# Altium schematic sheet SC945D_Alimentations.SchDoc: Alimentations
size 393 x 270 mm; CompanyName: Seccom; Address1: 521, rue du capt. François Garbit; Address2: 69440 Mornant; Address3: seccom@seccom.fr; Address4: www.seccom.fr; DocumentNumber: 3; SheetNumber: 3; SheetTotal: 9; PageSetup: Record=PageOptions|CenterHorizontal=True|CenterVertical=True|PrintScale=0.74|XCorrection=1.00|YCorrection=1.00|PrintKind=0|BorderSize=5000000|LeftOffset=0|BottomOffset=0|Orientation=2|PaperLength=1000|PaperWidth=1000|Scale=100|PaperSource=7|PrintQuality=-4|MediaType=1|DitherType=10|PaperKind=A4|PrintScaleMode=1
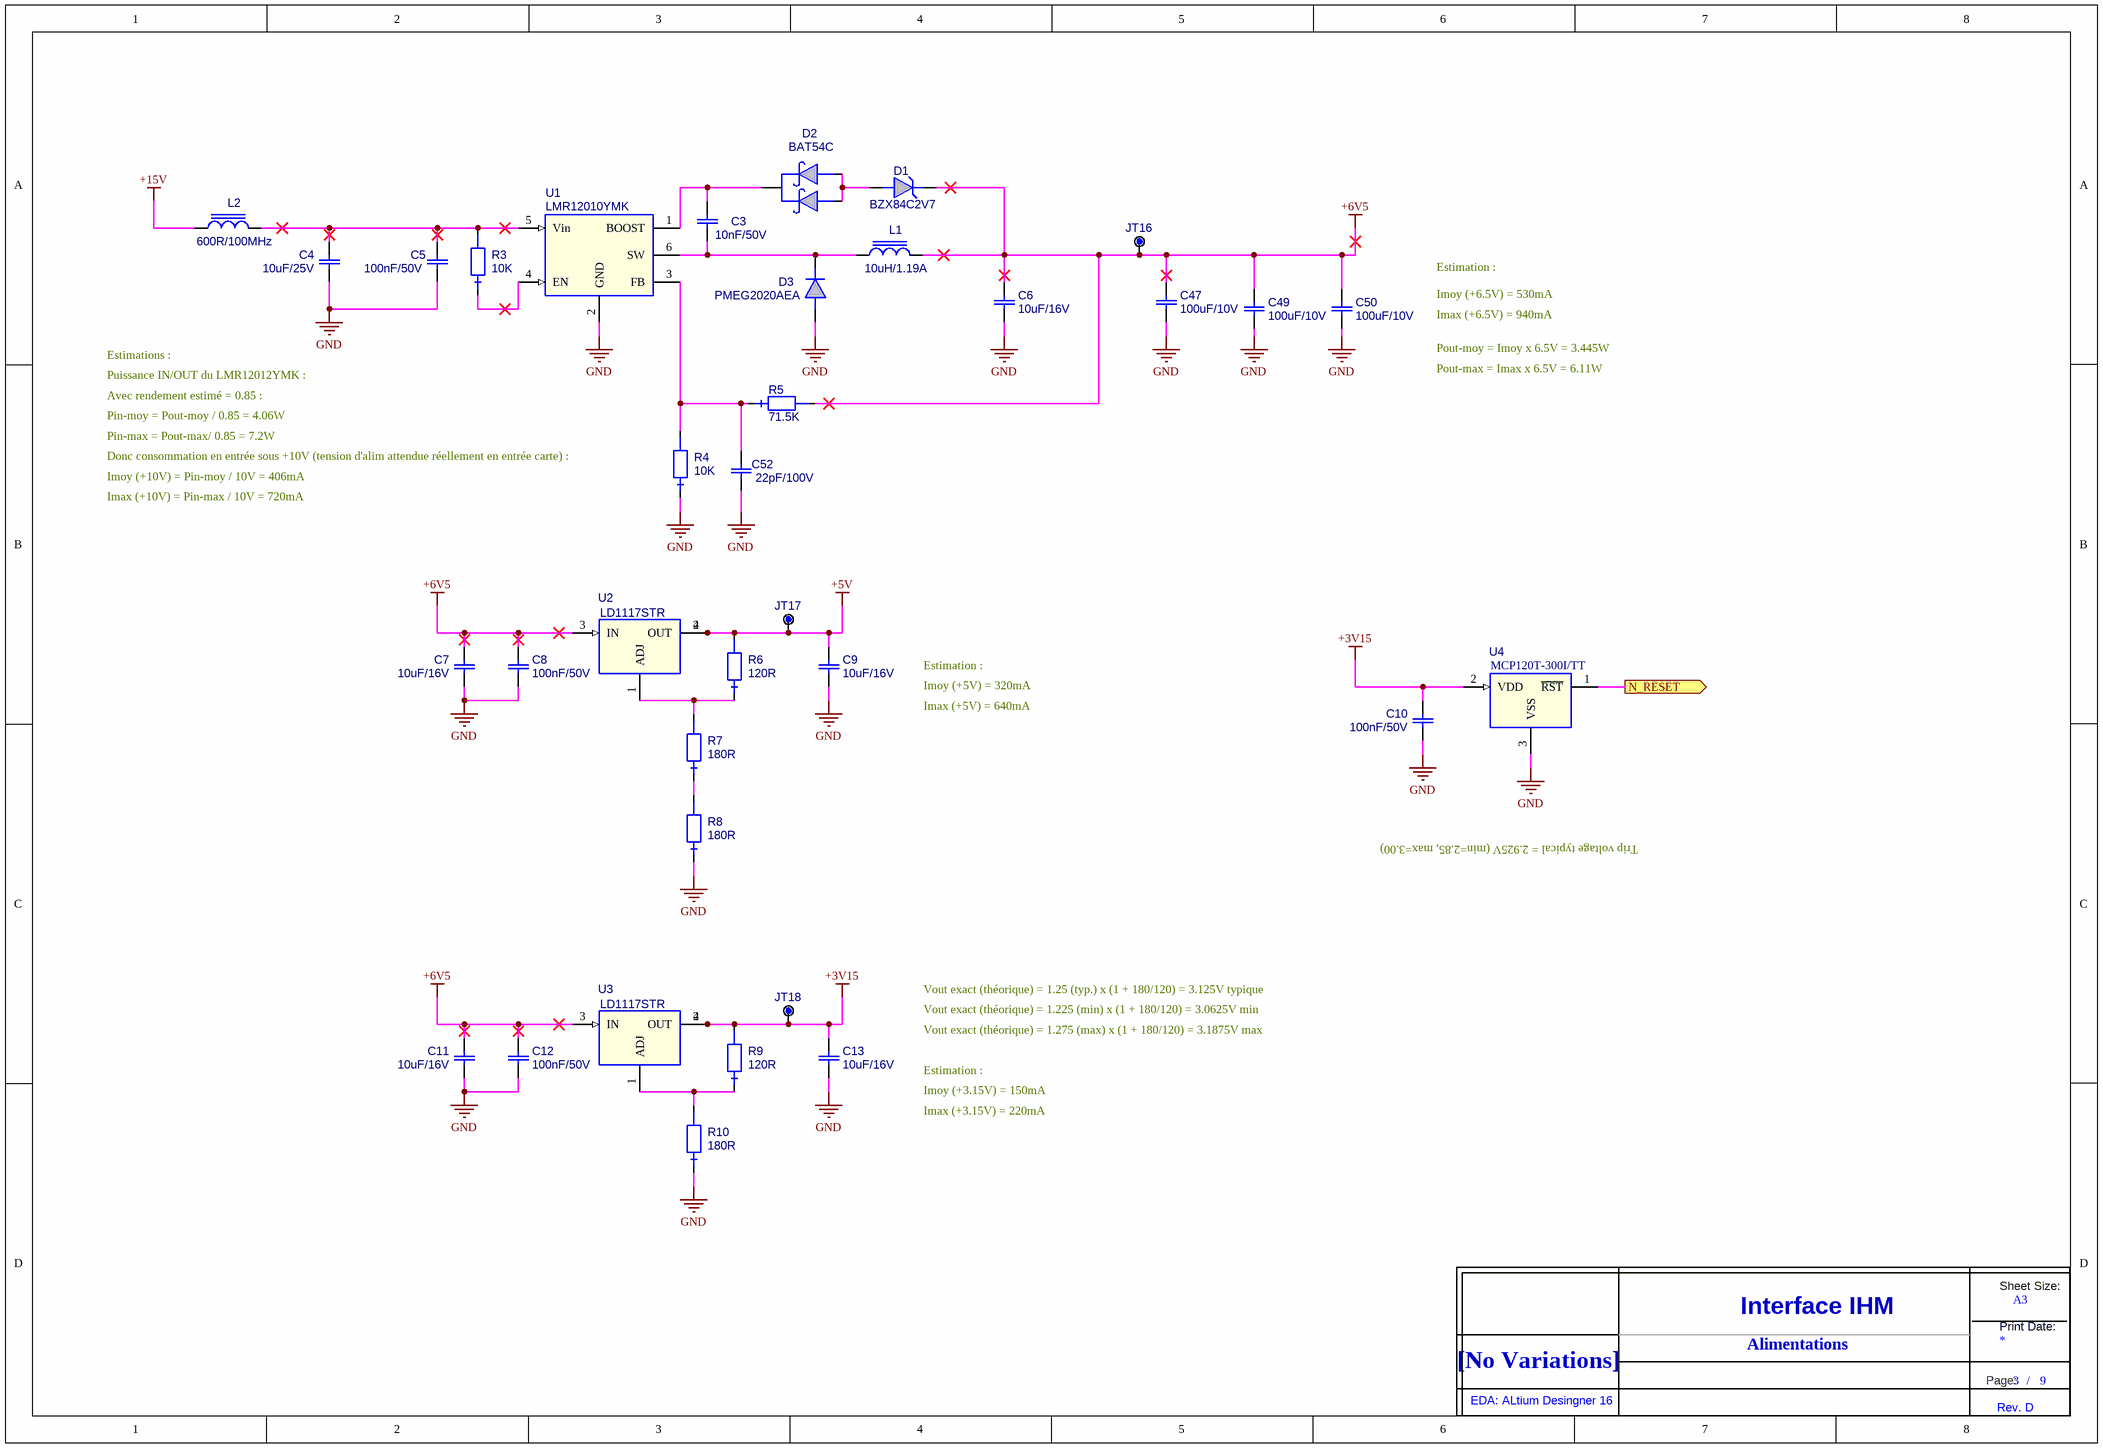
[diagram p0: SC945D_Alimentations.SchDoc]

## Parts
C3  value 10nF/50V  [0603_ReflowSoldering_CAP]  (hidden comment: C_0603_X7R_10%_10N-50V)
C4  value 10uF/25V  [0805_ReflowSoldering_CAP]  (hidden comment: C_0805_X5R_10%_10U-25V)
C5  value 100nF/50V  [0603_ReflowSoldering_CAP]  (hidden comment: C_0603_X7R_10%_100N-50V)
C6  value 10uF/16V  [0805_ReflowSoldering_CAP]  (hidden comment: C_0805_X5R_10%_10U-16V)
C7  value 10uF/16V  [0805_ReflowSoldering_CAP]  (hidden comment: C_0805_X5R_10%_10U-16V)
C8  value 100nF/50V  [0603_ReflowSoldering_CAP]  (hidden comment: C_0603_X7R_10%_100N-50V)
C9  value 10uF/16V  [0805_ReflowSoldering_CAP]  (hidden comment: C_0805_X5R_10%_10U-16V)
C10  value 100nF/50V  [0603_ReflowSoldering_CAP]  (hidden comment: C_0603_X7R_10%_100N-50V)
C11  value 10uF/16V  [0805_ReflowSoldering_CAP]  (hidden comment: C_0805_X5R_10%_10U-16V)
C12  value 100nF/50V  [0603_ReflowSoldering_CAP]  (hidden comment: C_0603_X7R_10%_100N-50V)
C13  value 10uF/16V  [0805_ReflowSoldering_CAP]  (hidden comment: C_0805_X5R_10%_10U-16V)
C47  value 100uF/10V  [1206_ReflowSoldering_CAP]  (hidden comment: C_1206_X5R_20%_100U-10V)
C49  value 100uF/10V  [1206_ReflowSoldering_CAP]  (hidden comment: C_1206_X5R_20%_100U-10V)
C50  value 100uF/10V  [1206_ReflowSoldering_CAP]  (hidden comment: C_1206_X5R_20%_100U-10V)
C52  value 22pF/100V  [0805_ReflowSoldering_CAP]  (hidden comment: C_0805_NPO_5%_22P-100V)
D1  BZX84C2V7  [SOT23_3L_ReflowSoldering]
D2  BAT54C  [SOT23_3L_ReflowSoldering]
D3  PMEG2020AEA  [SOD323_ReflowSoldering]
JT16  POINT_TEST_PAD_40MIL  [PAD_CMS_40X40_E]  (value not drawn)  (no BOM)
JT17  POINT_TEST_PAD_40MIL  [PAD_CMS_40X40_E]  (value not drawn)  (no BOM)
JT18  POINT_TEST_PAD_40MIL  [PAD_CMS_40X40_E]  (value not drawn)  (no BOM)
L1  value 10uH/1.19A  [SELF_WE-TPC_4.8x4.78_(type4828)]  (hidden comment: SELF_10UH_1.19A_744043100)
L2  value 600R/100MHz  [1206_ReflowSoldering_FERRITE]  (hidden comment: IND_FERRITE_1206_74279218)
R3  value 10K  [0603_ReflowSoldering_RES]  (hidden comment: RES_0603_1%_100PPM_10K)
R4  value 10K  [0603_ReflowSoldering_RES]  (hidden comment: RES_0603_1%_100PPM_10K)
R5  value 71.5K  [0603_ReflowSoldering_RES]  (hidden comment: RES_0603_1%_100PPM_71.5K)
R6  value 120R  [0603_ReflowSoldering_RES]  (hidden comment: RES_0603_1%_100PPM_120R)
R7  value 180R  [0603_ReflowSoldering_RES]  (hidden comment: RES_0603_1%_100PPM_180R)
R8  value 180R  [0603_ReflowSoldering_RES]  (hidden comment: RES_0603_1%_100PPM_180R)
R9  value 120R  [0603_ReflowSoldering_RES]  (hidden comment: RES_0603_1%_100PPM_120R)
R10  value 180R  [0603_ReflowSoldering_RES]  (hidden comment: RES_0603_1%_100PPM_180R)
Title_new?  DNI  (value not drawn)  (graphical)
U1  LMR12010YMK  [SOT23_6L]
U2  LD1117STR  [SOT223]
U3  LD1117STR  [SOT223]
U4  MCP120T-300I/TT  [SOT23_3L_ReflowSoldering]

## Ports
N_RESET (out)

## Nets
+3V15: C10.1 C13.2 JT18.1 R9.2 U3.2(OUT) U3.4(OUT) U4.2(VDD)
+5V: C9.2 JT17.1 R6.2 U2.2(OUT) U2.4(OUT)
+6V5: C6.2 C7.2 C8.1 C11.2 C12.1 C47.2 C49.2 C50.2 D1.3 JT16.1 L1.2 R5.2 U2.3(IN) U3.3(IN)
+15V: L2.1
GND: C4.1 C5.2 C6.1 C7.1 C8.2 C9.1 C10.2 C11.1 C12.2 C13.1 C47.1 C49.1 C50.1 C52.1 D3.A R4.1 R8.1 R10.1 U1.2(GND) U4.3(VSS)
N_RESET: U4.1(~{RST}) ; port N_RESET
NetC3_1: C3.1 D3.K L1.1 U1.6(SW)
NetC3_2: C3.2 D2.3 U1.1(BOOST)
NetC4_2: C4.2 C5.1 L2.2 R3.2 U1.5(Vin)
NetC52_2: C52.2 R4.2 R5.1 U1.3(FB)
NetD1_1: D1.1 D2.1 D2.2
NetR3_1: R3.1 U1.4(EN)
NetR6_1: R6.1 R7.2 U2.1(ADJ)
NetR7_1: R7.1 R8.2
NetR9_1: R9.1 R10.2 U3.1(ADJ)

Not connected (* = marked no-connect by the designer): D1 2; L1 3 4 5 6

## Notes on the sheet
- Imoy (+6.5V) = 530mA
- Imax (+6.5V) = 940mA
- Estimation :
- Estimations :
- Puissance IN/OUT du LMR12012YMK :
- Pout-moy = Imoy x 6.5V = 3.445W
- Pout-max = Imax x 6.5V = 6.11W
- Pin-moy = Pout-moy / 0.85 = 4.06W
- Avec rendement estimé = 0.85 :
- Pin-max = Pout-max/ 0.85 = 7.2W
- Imoy (+10V) = Pin-moy / 10V = 406mA
- Imax (+10V) = Pin-max / 10V = 720mA
- (near R4) Donc consommation en entrée sous +10V (tension d'alim attendue réellement en entrée carte) :
- Imoy (+5V) = 320mA
- Imax (+5V) = 640mA
- Trip voltage typical = 2.925V (min=2.85, max=3.00)
- Vout exact (théorique) = 1.25 (typ.) x (1 + 180/120) = 3.125V typique
- Vout exact (théorique) = 1.225 (min) x (1 + 180/120) = 3.0625V min
- Vout exact (théorique) = 1.275 (max) x (1 + 180/120) = 3.1875V max
- Imoy (+3.15V) = 150mA
- Imax (+3.15V) = 220mA
- Alimentations
- (in symbol Title_new) Sheet Size:; A3; Interface IHM; Print Date:; [No Variations]; Page:; /; EDA: ALtium Desingner 16; Rev. D

## Library data of the parts
C3 = C_0603_X7R_10%_10N-50V: Condensateur céramique, X7R, 10%, CMS 0603, 10nF/50V; Creation: FB (01/03/12); Boitier: 0603; Remarque: {Remarque}; Fabricant: Kemet; Ref Fab: C0603C103K5RAC; Coeff: 1; ComponentLink1URL: O:\_Documentation\Datasheets\Kemet\Condos_Ceramic_CMS.pdf; ComponentLink2URL: o:\_Documentation\Datasheets\_BOITIERS\PASSIF_CMS\; Config: *; ComponentLink1Description: Datasheet; ComponentLink2Description: Datasheet Boitier; Supplier 1: Farnell; Supplier 2: RadioSpares; Supplier Part Number 1: 1414609; Supplier Part Number 2: 2644595
C4 = C_0805_X5R_10%_10U-25V: Condensateur céramique, X5R, 10%, CMS 0805, 10uF/25V; Creation: FB (30/07/13); Boitier: 0805; Remarque: {Remarque}; Coeff: 1; Fabricant: Murata; Ref Fab: GRM21BR61E106KA73L; Verification: *; ComponentLink1URL: O:\_Documentation\Datasheets\Murata\Condensateur_GRM21BR61E106KA73.pdf; ComponentLink2URL: o:\_Documentation\Datasheets\_Boitiers\PASSIF_CMS\RC_0805_(2x1,25)_(Schneider).pdf; Config: *; ComponentLink1Description: Datasheet; ComponentLink2Description: Datasheet Boitier; Supplier 1: Farnell; Supplier Part Number 1: 1735530; Supplier 2: Mouser; Supplier Part Number 2: 81-GRM21BR61E106KA3L
C5 C8 C10 C12 = C_0603_X7R_10%_100N-50V: Condensateur céramique, X7R, 10%, CMS 0603, 100nF/50V; Creation: FB (29/02/12); Boitier: 0603; Remarque: {Remarque}; Fabricant: Kemet; Ref Fab: C0603C104K5RAC; Coeff: 1; ComponentLink1URL: O:\_Documentation\Datasheets\Kemet\Condos_Ceramic_CMS.pdf; ComponentLink2URL: o:\_Documentation\Datasheets\_BOITIERS\PASSIF_CMS\; Config: *; ComponentLink1Description: Datasheet; ComponentLink2Description: Datasheet Boitier; Supplier 1: Farnell; Supplier Part Number 1: 1288255
C6 C7 C9 C11 C13 = C_0805_X5R_10%_10U-16V: Condensateur céramique, X5R, 10%, CMS 0805, 10uF/16V; Creation: FB (02/10/12); Boitier: 0805; Remarque: {Remarque}; Coeff: 1; Fabricant: Kemet; Ref Fab: C0805C106K4PAC; Verification: *; ComponentLink1URL: O:\_Documentation\Datasheets\Kemet\Condos_Ceramic_CMS.pdf; ComponentLink2URL: o:\_Documentation\Datasheets\_Boitiers\PASSIF_CMS\RC_0805_(2x1,25)_(Schneider).pdf; Config: *; ComponentLink1Description: Datasheet; ComponentLink2Description: Datasheet Boitier; Supplier 1: Farnell; Supplier Part Number 1: 1288204; Supplier 2: Mouser; Supplier Part Number 2: 80-C0805C106K4P
C47 C49 C50 = C_1206_X5R_20%_100U-10V: Condensateur céramique, X5R, 20%, CMS 1206, 100uF/10V; Creation: ZA (13/09/13); Boitier: 1206; Remarque: {Remarque}; Fabricant: TDK; Coeff: 1; Ref Fab: C3216X5R1A107M160AC; ComponentLink1URL: O:\_Documentation\Datasheets\TDK\general_B11.pdf; ComponentLink2URL: o:\_Documentation\Datasheets\TDK\Capacitors_MLCC_cseries.pdf; ComponentLink1Description: Datasheet; ComponentLink2Description: Datasheet Boitier; Supplier 1: Farnell; Supplier Part Number 1: 2211193; Supplier 2: Mouser; Supplier Part Number 2: 810-C3216X5R1A107M
C52 = C_0805_NPO_5%_22P-100V: Condensateur céramique, NPO, 5%, CMS 0805; Creation: LJ; Verification: LJ (28/05/04); Boitier: 0805; Remarque: {Remarque}; Coeff: 1; Fabricant: AVX; Ref Fab: 08051A220JAT2A; ComponentLink1URL: o:\_Documentation\Datasheets\BC_Components\Condo_CMS_NPO-X7R-Y5V.pdf; ComponentLink2URL: o:\_Documentation\Datasheets\_BOITIERS\PASSIF_CMS\RC_0805_(2x1,25)_(Schneider).PDF; Config: *; ComponentLink1Description: Datasheet; ComponentLink2Description: Datasheet Boitier; Supplier 1: Farnell; Supplier 2: Mouser; Supplier Part Number 1: 317500; Supplier Part Number 2: 581-08051A220J
D1 = BZX84C2V7: Diode Zener, série BZX84C, 0.3W, +/-5%, 2.7V, CMS; Creation: PDP (10/07/12); Verification: FB (07/09/12); Boitier: SOT23_3L; Remarque: {Remarque}; Coeff: 1; Fabricant: NXP; ComponentLink1URL: o:\_Documentation\Datasheets\NXP\BZX84_SERIES.pdf; ComponentLink2URL: o:\_Documentation\Datasheets\_BOITIERS\ACTIF_CMS\SOT\SOT_23_3P_(Schneider).PDF; Config: *; ComponentLink1Description: Datasheet; ComponentLink2Description: Datasheet Boitier; Ref Fab: BZX84C2V7; Supplier 1: Farnell; Supplier Part Number 1: 1081415; Supplier 2: Mouser; Supplier Part Number 2: 771-BZX84-C2V7-T/R; Value: BZX84C2V7
D2 = BAT54C: Diode Schottky double, BAT54 cathode com, Vrrm=30V, If=300mA, Vf=0.4Vmax, CMS; Creation: LJ (14/05/02); Reference: 000597/00; Boitier: SOT23_3L; Remarque: {Remarque}; Coeff: 1; Fabricant: NXP; Verification: LJ (14/05/02); ComponentLink1URL: O:\_Documentation\Datasheets\NXP\BAT54_series.pdf; ComponentLink2URL: o:\_Documentation\Datasheets\_BOITIERS\ACTIF_CMS\SOT\SOT_23_3P_(Schneider).PDF; Config: *; ComponentLink1Description: Datasheet; ComponentLink2Description: Datasheet Boitier; Ref Fab: BAT54C; Supplier 1: Farnell; Supplier Part Number 1: 1081192; Value: BAT54C
D3 = PMEG2020AEA: Diode Schottky, Vrrm=20V, If=2A, Vf=0.45V, CMS; Creation: PDP (10/07/12); Boitier: SOD323; Remarque: {Remarque}; Coeff: 1; Fabricant: NXP; Verification: *; ComponentLink1URL: o:\_Documentation\Datasheets\NXP\PMEG2020AEA.PDF; ComponentLink2URL: o:\_Documentation\Datasheets\_BOITIERS\ACTIF_CMS\SOD\SOD_80_(MLL34)_(Schneider).PDF; Config: *; ComponentLink1Description: Datasheet; ComponentLink2Description: Datasheet Boitier; Ref Fab: PMEG2020AEA; Value: PMEG2020AEA
JT16-JT18 = POINT_TEST_PAD_40MIL: Point de test sur CI, pad de diamètre 1.016mm (40mils); Creation: FB (04/10/12); Remarque: {Remarque}; Coeff: 1; Value: POINT_TEST; Config: *; ComponentLink1Description: Datasheet; ComponentLink2Description: Datasheet Boitier
L1 = SELF_10UH_1.19A_744043100: Inductance bobinée CMS, 10uH +/- 10%, I=1.19A, Rdc=0.095R, SRF=40MHz, -40/+85°C; Creation: LJ (02/08/12); Boitier: 4.8x4.8_h2.8mm; Coeff: 1; Fabricant: Wurth Elektronik; Verification: *; ComponentLink1URL: O:\_Documentation\Datasheets\Wurth_Elektronik\744043100.pdf; ComponentLink2URL: O:\_Documentation\Datasheets\Wurth_Elektronik\744043100.pdf; Remarque: *; Config: *; ComponentLink1Description: Datasheet; ComponentLink2Description: Datasheet Boitier; Ref Fab: 744043100
L2 = IND_FERRITE_1206_74279218: Inductance à ferrite multicouches CMS, imp=600R@100MHz, +/-25%, Rdc=100mR, I=2A; Creation: LJ (12/08/08); Reference: 000049/00; Boitier: 1206; Remarque: Alternative aux selfs de choc; Coeff: 1; Fabricant: Wurth Elektronik; Verification: *; ComponentLink1URL: o:\_Documentation\Datasheets\Wurth_Elektronik\74279218.pdf; ComponentLink2URL: o:\_Documentation\Datasheets\_Boitiers\PASSIF_CMS\RC_1206_(3,2x1,6)_(Schneider).pdf; Config: *; ComponentLink1Description: Datasheet; ComponentLink2Description: Datasheet Boitier; Ref Fab: 74279218
R3 R4 = RES_0603_1%_100PPM_10K: Résistance, 0.100W, 1%, 100ppm, 75V, 10K; Creation: JPL (05/07/12); Boitier: 0603; Remarque: {Remarque}; Fabricant: Vishay; Ref Fab: CRCW060310K0FKEA; Coeff: 1; Verification: *; ComponentLink1URL: O:\_Documentation\Datasheets\Vishay\Resistances_D-CRCWe3.pdf; ComponentLink2URL: o:\_Documentation\Datasheets\_BOITIERS\PASSIF_CMS\; Config: *; ComponentLink1Description: Datasheet; ComponentLink2Description: Datasheet Boitier; Supplier 1: Farnell; Supplier 2: RadioSpares; Supplier Part Number 1: 1469748; Supplier Part Number 2: 6789667
R5 = RES_0603_1%_100PPM_71.5K: Résistance, 0.100W, 1%, 100ppm, 75V, 71.5K; Creation: FB (07/09/12); Boitier: 0603; Remarque: {Remarque}; Fabricant: Vishay; Ref Fab: CRCW060371K5FKEA; Coeff: 1; Verification: *; ComponentLink1URL: O:\_Documentation\Datasheets\Vishay\Resistances_D-CRCWe3.pdf; ComponentLink2URL: o:\_Documentation\Datasheets\_BOITIERS\PASSIF_CMS\; Config: *; ComponentLink1Description: Datasheet; ComponentLink2Description: Datasheet Boitier; Supplier 1: Farnell; Supplier Part Number 1: 1469837; Supplier 2: Mouser; Supplier Part Number 2: 71-CRCW0603-71.5K-E3
R6 R9 = RES_0603_1%_100PPM_120R: Résistance, 0.100W, 1%, 100ppm, 75V, 120R; Creation: FB (07/09/12); Boitier: 0603; Remarque: {Remarque}; Fabricant: Vishay; Ref Fab: CRCW0603120RFKEA; Coeff: 1; Verification: *; ComponentLink1URL: O:\_Documentation\Datasheets\Vishay\Resistances_D-CRCWe3.pdf; ComponentLink2URL: o:\_Documentation\Datasheets\_BOITIERS\PASSIF_CMS\; Config: *; ComponentLink1Description: Datasheet; ComponentLink2Description: Datasheet Boitier; Supplier 1: Farnell; Supplier Part Number 1: 1652832; Supplier 2: Mouser; Supplier Part Number 2: 71-CRCW0603-120-E3
R7 R8 R10 = RES_0603_1%_100PPM_180R: Résistance, 0.100W, 1%, 100ppm, 75V, 180R; Creation: FB (06/09/12); Boitier: 0603; Remarque: {Remarque}; Fabricant: Vishay; Ref Fab: CRCW0603180RFKEA; Coeff: 1; Verification: *; ComponentLink1URL: O:\_Documentation\Datasheets\Vishay\Resistances_D-CRCWe3.pdf; ComponentLink2URL: o:\_Documentation\Datasheets\_BOITIERS\PASSIF_CMS\; Config: *; ComponentLink1Description: Datasheet; ComponentLink2Description: Datasheet Boitier; Supplier 1: Farnell; Supplier Part Number 1: 1469762; Supplier 2: Mouser; Supplier Part Number 2: 71-CRCW0603-180-E3
Title_new? = Title_new
U1 = LMR12010YMK: Régulateur ajustable step down, 0.8~20V, 1A, Vin=3~20V, -40/+125°C, CMS; Creation: PDP (10/07/12); Verification: LJ (02/08/12); Boitier: TSOT-6; Remarque: {Remarque}; Coeff: 1; Fabricant: National Semiconductor; ComponentLink1URL: O:\_Documentation\Datasheets\National_SemiConductors\LMR12010.pdf; ComponentLink2URL: o:\_Documentation\Datasheets\_Boitiers\ACTIF_CMS\; ComponentLink1Description: Datasheet; ComponentLink2Description: Datasheet Boitier; Ref Fab: LMR12010YMK; Supplier 1: Farnell; Supplier Part Number 1: 2060645; Supplier 2: Mouser; Supplier Part Number 2: 926-LMR12010YMKENOPB; Value: LMR12010YMK
U2 U3 = LD1117STR: Régulateur de tension ajustable positif, 1.25~15V, 0.8A, LDO (1V), Vin=15Vmax, CMS; Creation: FB (07/09/12); Remarque: {Remarque}; Coeff: 1; Fabricant: ST; Boitier: SOT223; ComponentLink2URL: o:\_Documentation\Datasheets\_Boitiers\ACTIF_CMS\SOT & TSOT\SOT223_4_(Schneider).pdf; Config: *; ComponentLink1URL: o:\_Documentation\Datasheets\ST\LD1117.pdf; ComponentLink1Description: Datasheet; ComponentLink2Description: Datasheet Boitier; Ref Fab: LD1117STR; Value: LD1117STR
U4 = MCP120T-300I/TT: Microcontroller Supervisory Circuit with Open Drain Output, Active Low, 2.925V trip point; Creation: PDP (10/07/2012); Verification: FB (11/09/12); Boitier: SOT23_3L; Remarque: {Remarque}; Coeff: 1; Fabricant: Microchip; Config: *; ComponentLink1Description: Datasheet; ComponentLink1URL: o:\_Documentation\Datasheets\MicroChip\MCP120.pdf; ComponentLink2Description: Datasheet Boitier; ComponentLink2URL: o:\_Documentation\Datasheets\_Boitiers\ACTIF_CMS\SOT & TSOT\SOT23_3_(Schneider).pdf; Supplier 1: Farnell; Supplier Part Number 1: 1292233; Supplier 2: Mouser; Supplier Part Number 2: 579-MCP120T-300I/TT; Ref Fab: MCP120T-300I/TT; Value: MCP120T-300I/TT